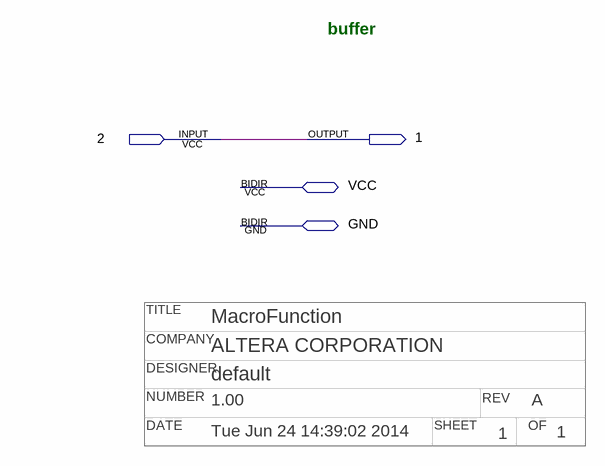
[diagram p0: schematic sheet]
// Quartus schematic npbuf.bdf as structural Verilog: 0 symbols, 4 pins
// Title block: TITLE: MacroFunction; COMPANY: ALTERA CORPORATION; DESIGNER: default; NUMBER: 1.00; REV: A; DATE: Tue Jun 24 14:39:02 2014; SHEET: 1; OF: 1
module npbuf (
  input  \2 ,
  inout  VCC,
  inout  GND,
  output \1 
);


  assign \1  = \2 ;

  // Notes on the sheet:
  //   buffer
endmodule
